# EasyEDA schematic SCH_TempBoard-vB_2024-06-08.json
TITLE: Small board for temp sensors at batteries; REV: 1.0; Date: 2022-03-08; Sheet: 1/1; Drawn By: Steve Schroeder; Company: Your Company
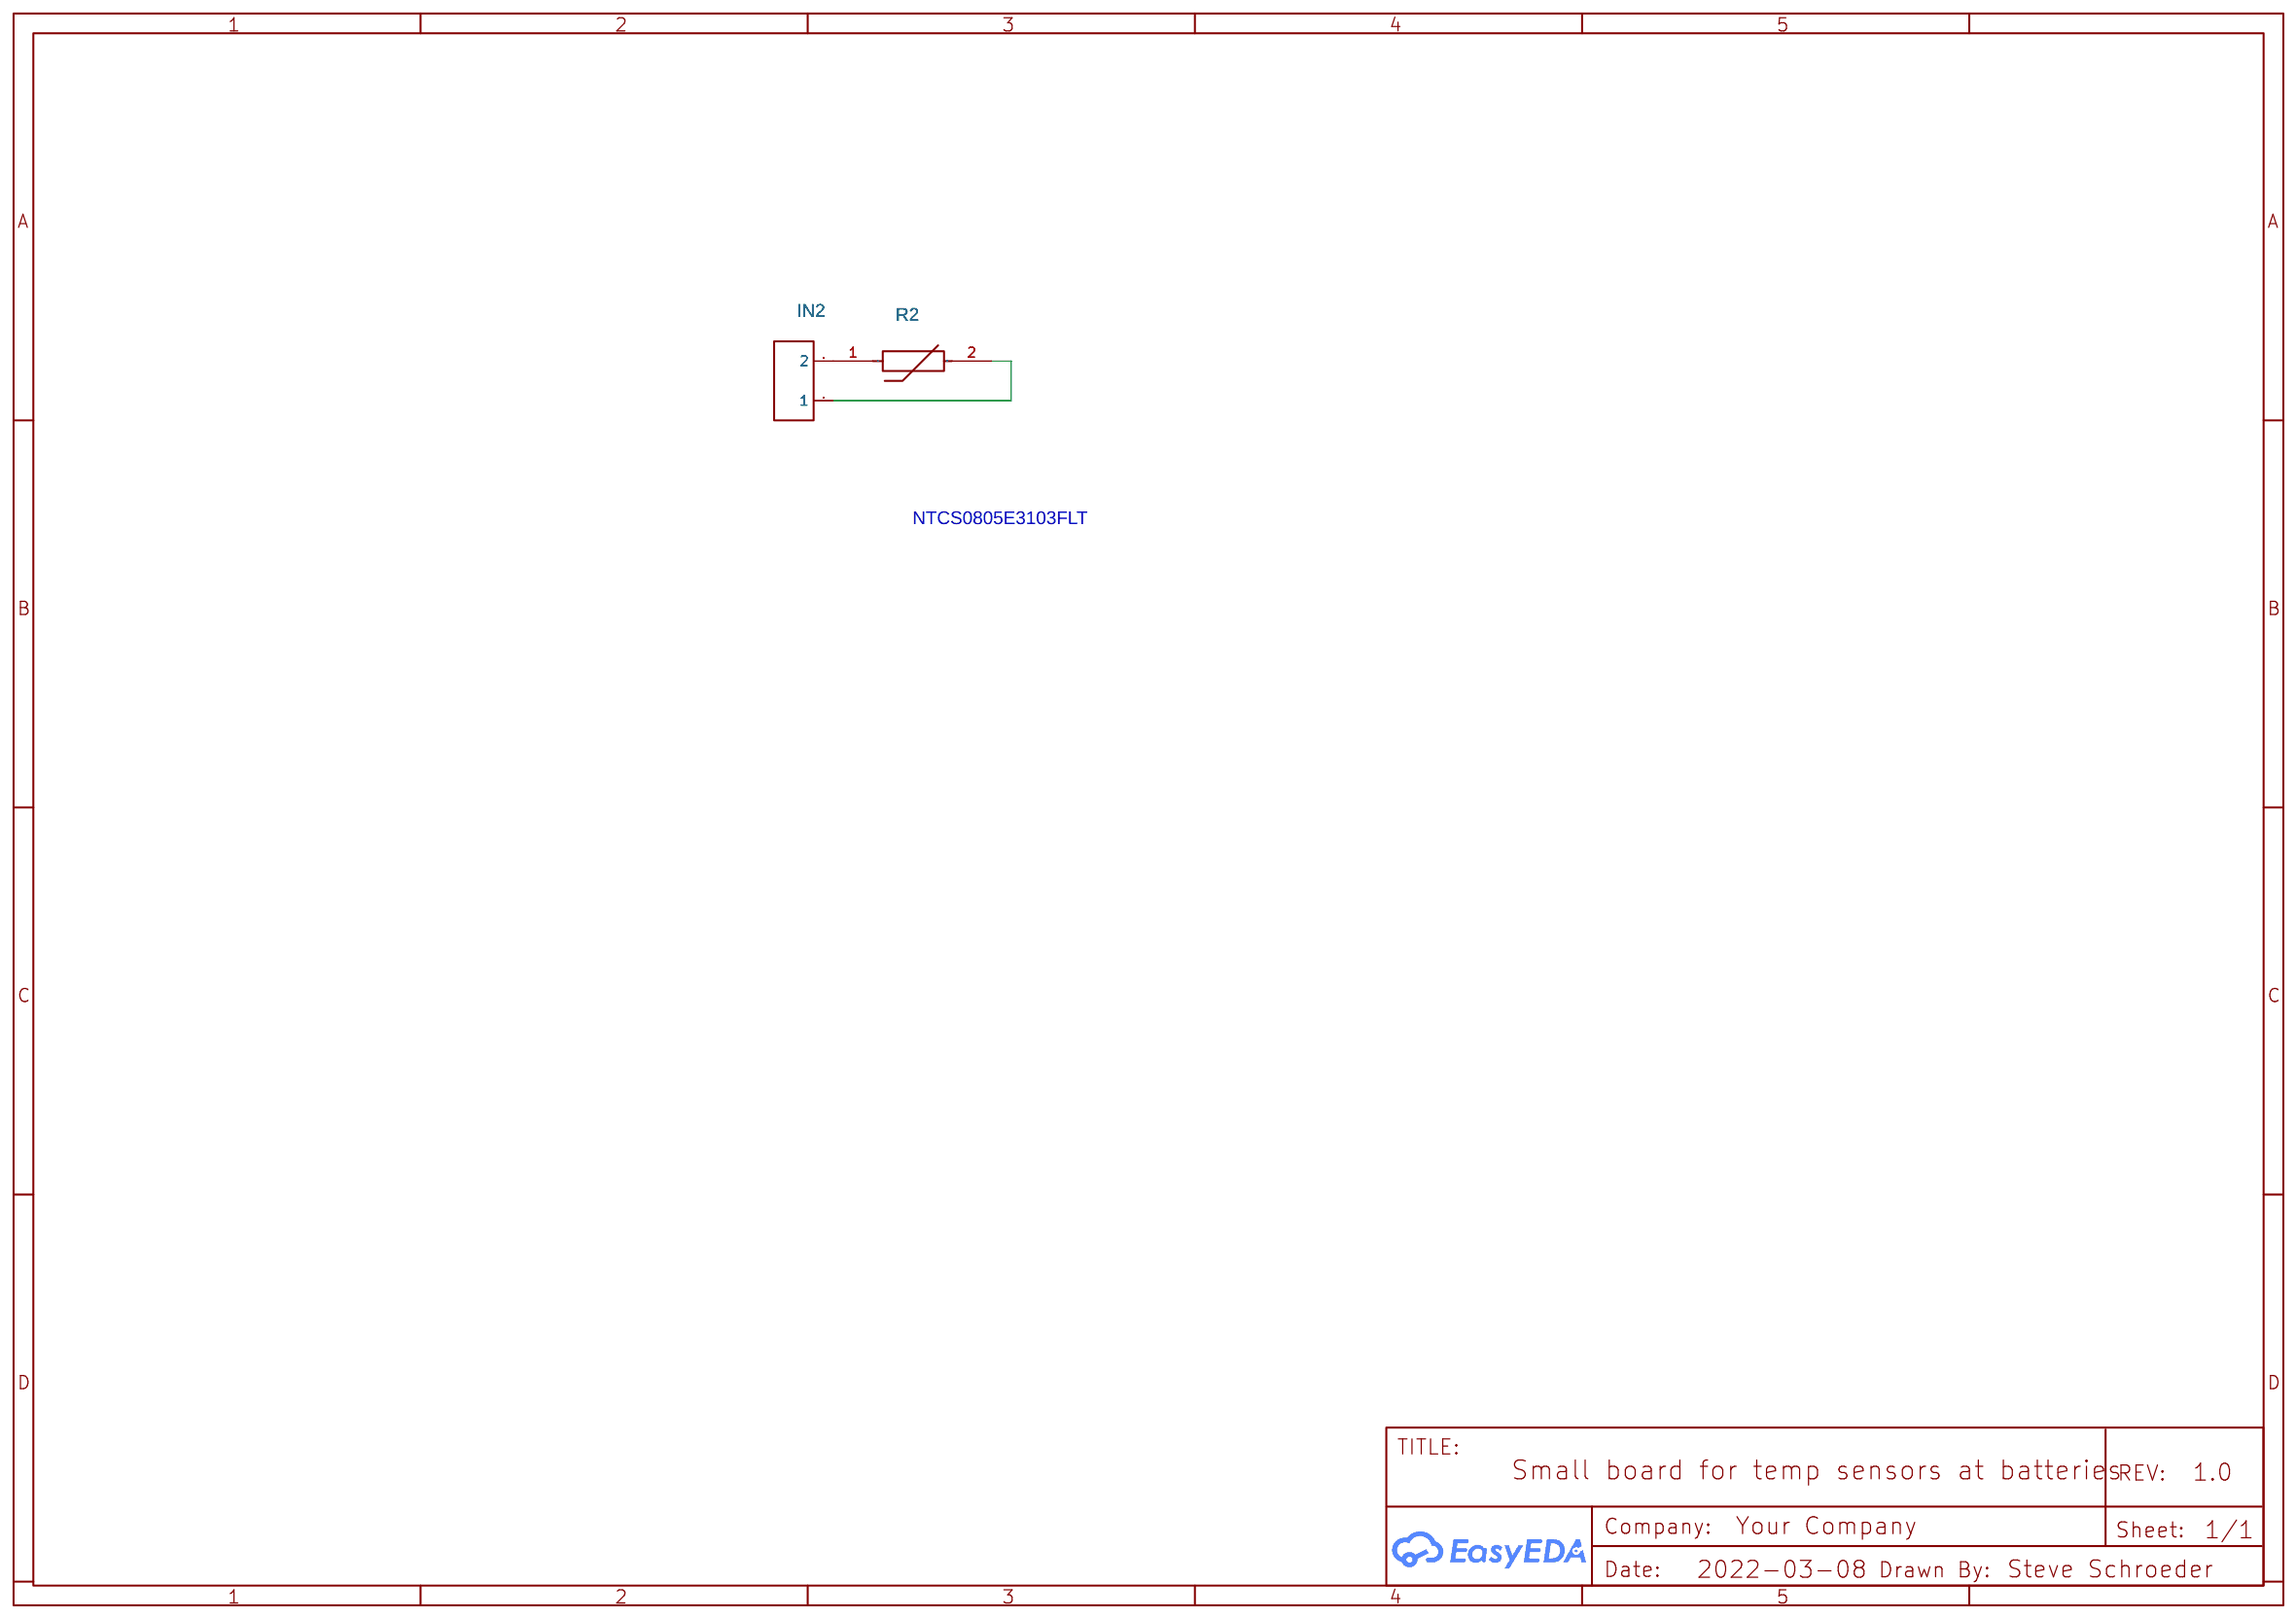
[diagram p0: schematic sheet]

## Parts
IN2  Header-Male-2.54_1x2  [HDR-TH_2P-P2.54-V-M-1]
R2  NTCS0805E3103JHT  [R0805]

## Library data of the parts
IN2 = Header-Male-2.54_1x2: Supplier: LCSC; Manufacturer: TE Connectivity; Manufacturer Part: 826629-2; Supplier Part: C86471; JLCPCB Part Class: Extended Part
R2 = NTCS0805E3103JHT: Supplier: LCSC; Supplier Part: C511025; Manufacturer: Vishay Intertech; Contributor: LCSC

## Nets
Net-(IN2-1): IN2.1 R2.2
Net-(IN2-2): IN2.2 R2.1

## Notes on the sheet
- NTCS0805E3103FLT
